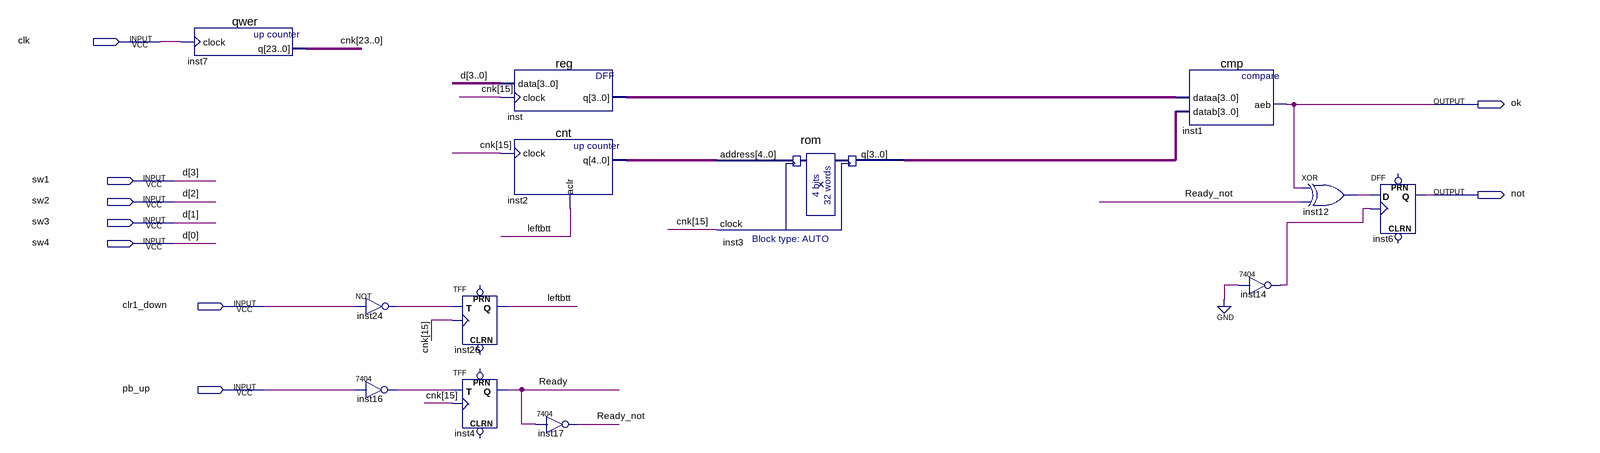
[diagram p0: schematic sheet]
// Quartus schematic OXPAHA (1).bdf as structural Verilog: 13 symbols, 9 pins
module \OXPAHA_(1)  (
  input  clk,
  input  sw1,
  input  sw2,
  input  sw3,
  input  sw4,
  input  clr1_down,
  input  pb_up,
  output ok,
  output \not 
);

  wire inst12_out, inst14_1, inst16_1, inst24_out, leftbtt, Ready, Ready_not;
  wire [3:0] inst3_q, inst_q;
  wire [4:0] inst2_q;
  wire [23:0] cnk;

  qwer inst7 (.clock(clk), .q(cnk));
  not inst24 (inst24_out, clr1_down);
  \7404  inst16 (.\2 (pb_up), .\1 (inst16_1));
  TFF inst26 (.T(inst24_out), .CLK(cnk[15]), .Q(leftbtt));  // open: PRN, CLRN
  TFF inst4 (.T(inst16_1), .CLK(cnk[15]), .Q(Ready));  // open: PRN, CLRN
  \reg  inst (.data({sw1, sw2, sw3, sw4}), .clock(cnk[15]), .q(inst_q));
  cnt inst2 (.clock(cnk[15]), .aclr(leftbtt), .q(inst2_q));
  \7404  inst17 (.\2 (Ready), .\1 (Ready_not));
  rom inst3 (.address(inst2_q), .clock(cnk[15]), .q(inst3_q));
  cmp inst1 (.dataa(inst_q), .datab(inst3_q), .aeb(ok));
  \7404  inst14 (.\2 (1'b0), .\1 (inst14_1));
  xor inst12 (inst12_out, ok, Ready_not);
  DFF inst6 (.CLK(inst14_1), .D(inst12_out), .Q(\not ));  // open: CLRN, PRN

  // Other names for the same wires on the sheet: d[3:0] = {sw1, sw2, sw3, sw4}
endmodule
